# EAGLE design LB_BIT_w16-NAND-v03(1_2) (EAGLE 6.6.0)
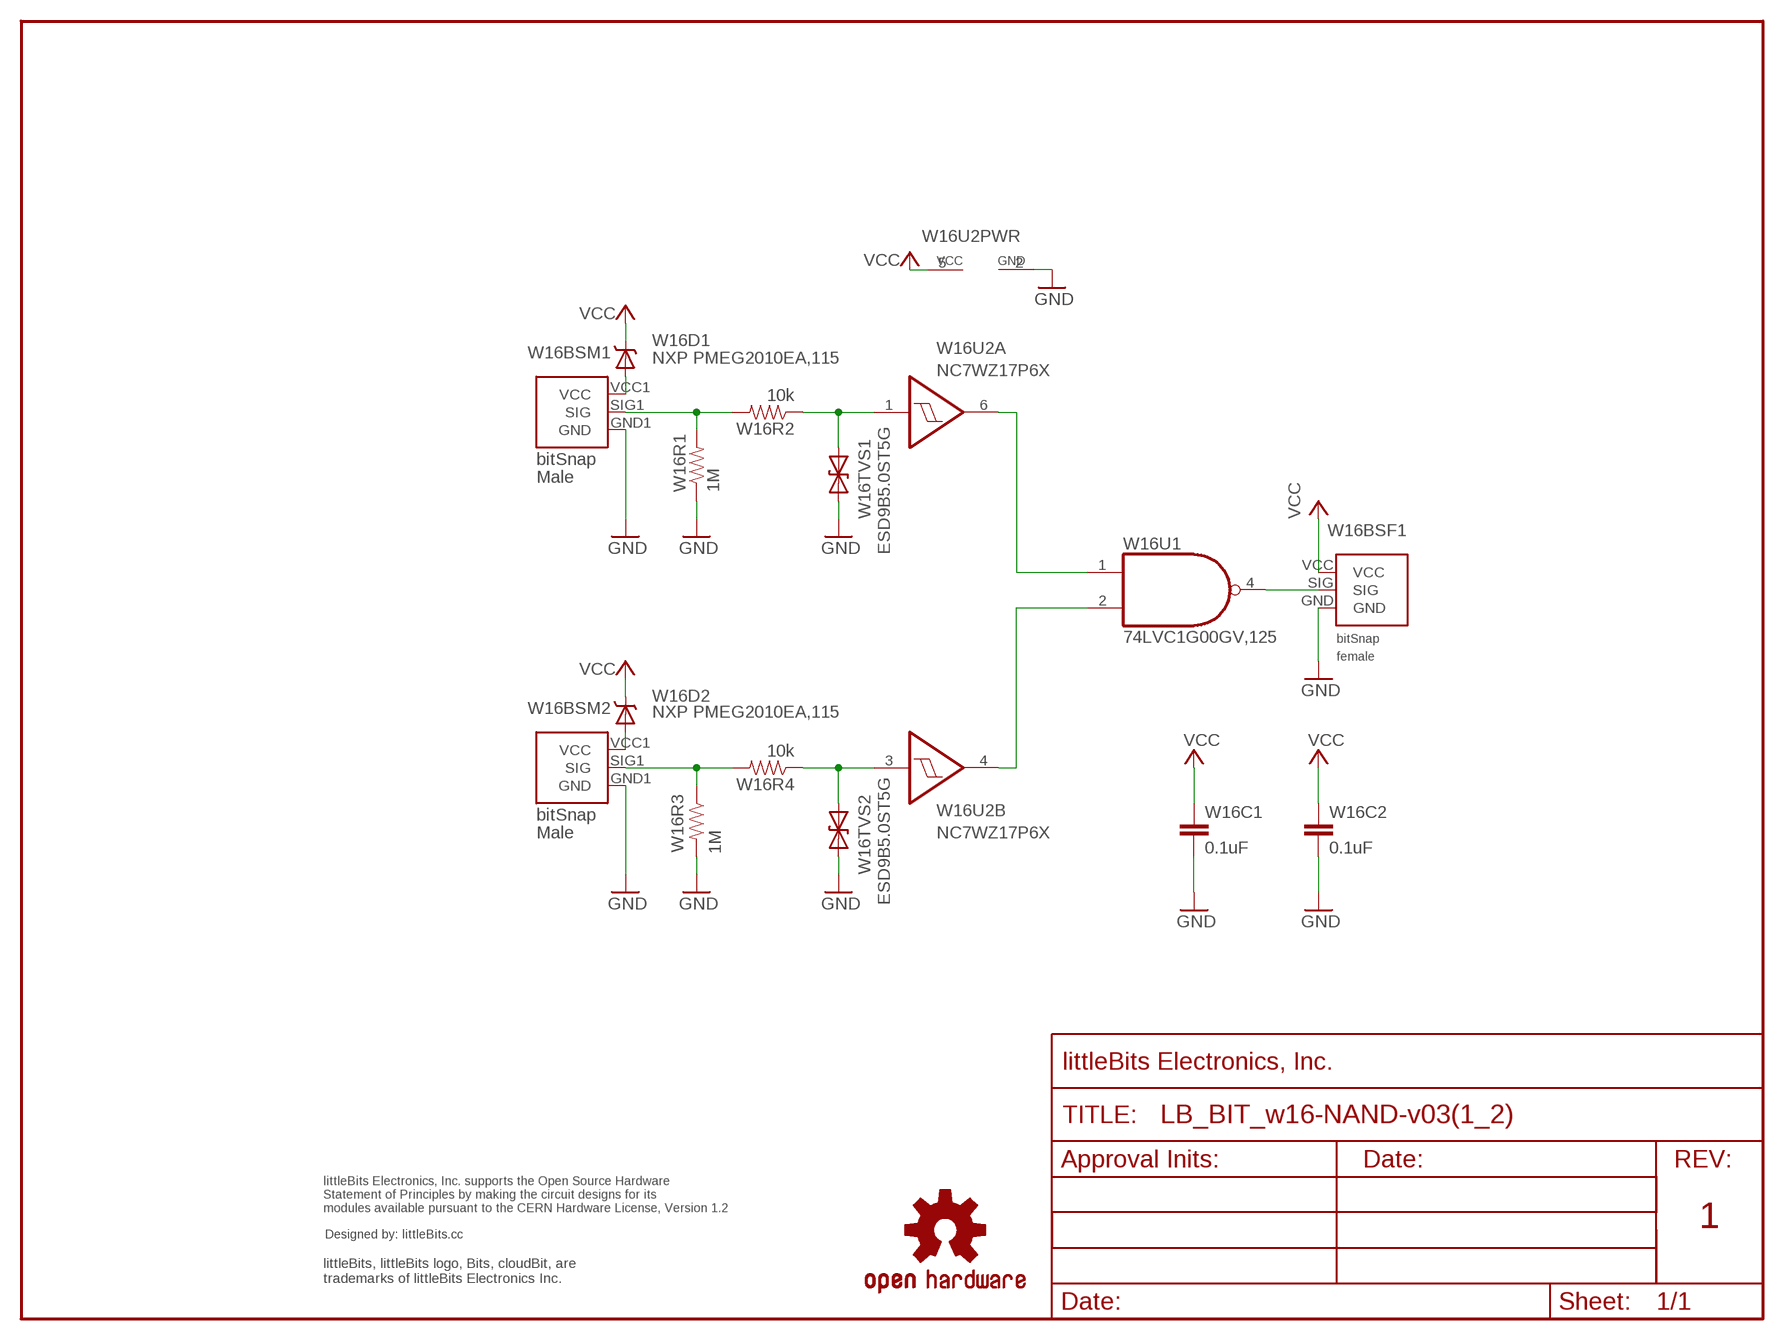
[diagram p0: schematic, sheet 1]

## Parts
U$1  OSHWCREDIT  [OSHWCREDIT]
U$2  OSHW-LOGOL  [OSHW-LOGO-L]
U$7  FRAME-LETTER-OHWOHW  [FABDWG01-OHW]
W16BSF1  BITSNAP_V03_FEMALE  [BITSNAP_V03_FEMALE]
W16BSM1  BITSNAP_V03_MALE  [BITSNAP_V03_MALE]
W16BSM2  BITSNAP_V03_MALE  [BITSNAP_V03_MALE]
W16C1  0.1uF  CAPCAP-0603  [CAP-0603]
W16C2  0.1uF  CAPCAP-0603  [CAP-0603]
W16D1  NXP PMEG2010EA,115  DIODE-SCHOTTKY  [SOD-323]
W16D2  NXP PMEG2010EA,115  DIODE-SCHOTTKY  [SOD-323]
W16R1  1M  RESISTOR0603-RES  [0603-RES]
W16R2  10k  RESISTOR0603-RES  [0603-RES]
W16R3  1M  RESISTOR0603-RES  [0603-RES]
W16R4  10k  RESISTOR0603-RES  [0603-RES]
W16TVS1  ESD9B5.0ST5G  DIODE-TVSSOD-923  [SOD-923]
W16TVS2  ESD9B5.0ST5G  DIODE-TVSSOD-923  [SOD-923]
W16U1  74LVC1G00GV,125  74LVC1G00DBV  [SOT23-5]
W16U2  NC7WZ17P6X  SCHMITT_TRIGGER_NON_INVERTINGNC7WZ17  [SC70-6]

## Nets
GND: W16BSF1.GND W16BSM1.GND1(GND) W16BSM2.GND1(GND) W16C1.2 W16C2.2 W16R1.1 W16R3.2 W16TVS1.1(A) W16TVS2.1(A) W16U2.2(PWR:GND)
N$1: W16BSM2.SIG1(SIG) W16R3.1 W16R4.2
N$2: W16U1.1(I0) W16U2.6(A:O)
N$3: W16BSM1.VCC1(VCC) W16D1.2(A)
N$4: W16U1.2(I1) W16U2.4(B:O)
N$5: W16BSM2.VCC1(VCC) W16D2.2(A)
N$6: W16BSM1.SIG1(SIG) W16R1.2 W16R2.2
N$7: W16R2.1 W16TVS1.2(C) W16U2.1(A:I)
N$8: W16R4.1 W16TVS2.2(C) W16U2.3(B:I)
N$9: W16BSF1.SIG W16U1.4(O)
VCC: W16BSF1.VCC W16C1.1 W16C2.1 W16D1.1(C) W16D2.1(C) W16U2.5(PWR:VCC)

## Notes on the sheet
- 1

## Power pins joined to a net without a drawn wire
GND: W16U1.3(GND)
VCC: W16U1.5(VCC)

## Library data of the parts
U$1 = LITTLEBITS:OSHWCREDIT
U$2 = SparkFun_NEW:OSHW-LOGO: Open Source Hardware Logo This logo indicates the piece of hardware it is found on incorporates a OSHW license and/or adheres to the definition of open source hardware found here: http://freedomdefined.org/OSHW
U$7 = LITTLEBITS:FRAME-LETTER-OHW
W16BSF1 = bitSnap:BITSNAP_V03_FEMALE
W16BSM1 W16BSM2 = bitSnap:BITSNAP_V03_MALE
W16C1 W16C2 = LITTLEBITS:CAP
W16D1 W16D2 = LITTLEBITS:DIODE-SCHOTTKY
W16R1-W16R4 = SparkFun:RESISTOR: Resistor Basic schematic elements and footprints for 0603, 1206, and PTH 1/10th watt (small) resistors.
W16TVS1 W16TVS2 = LITTLEBITS:DIODE-TVS: Bidirectional Transient Voltage Suppression Diode: Device conducts in avalanche mode after reaching a part dependent voltage threshold. Used for limiting voltage spikes on ESD sensitive inputs and outputs.; IEC_ESD_PROT0: +/-18kV; LB_PN: ?; MPN: ESD9B5.0ST5G; V_CLAMP: ?; V_OPERATION: 5V
W16U1 = 74xx-little-us:74*1G00: 2-input NAND gate
W16U2 = LITTLEBITS:SCHMITT_TRIGGER_NON_INVERTING

## Board
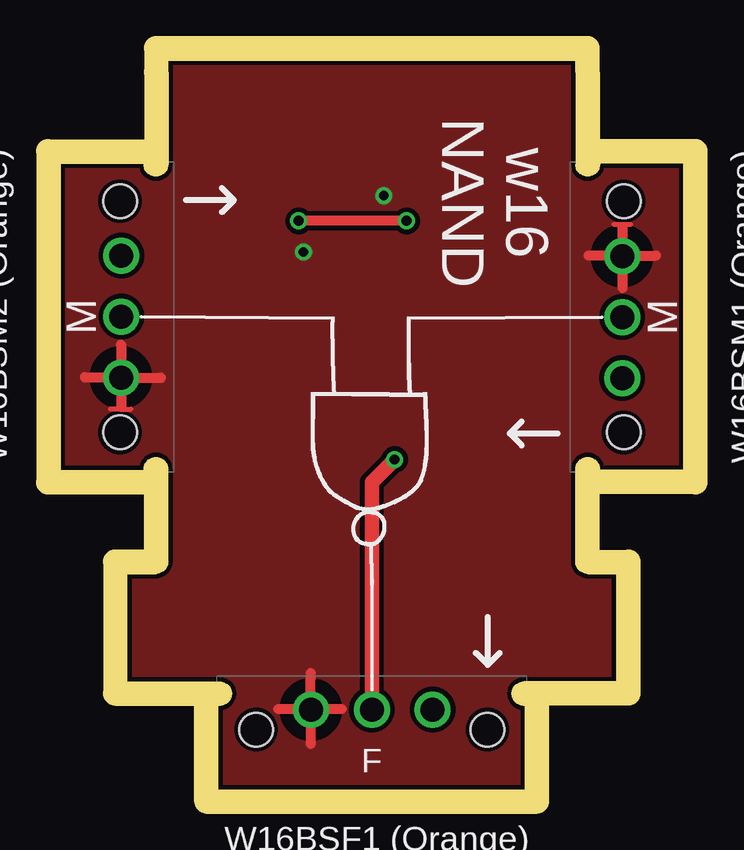
[diagram p1: board, top side]
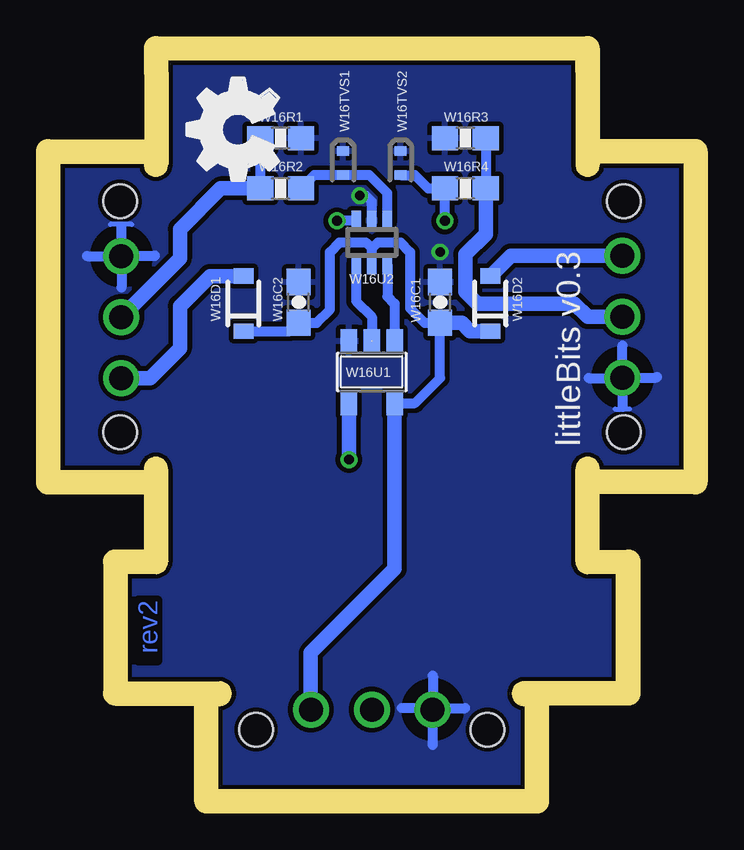
[diagram p2: board, bottom side, seen from below]

Size 26 x 30.4 mm. Coordinates in mm from the lower left corner, seen from the top.
Outline: 2.8,4.5 2.8,9 4,9 arc90 4.5,9.5 4.5,9.51
Outline: 23.2,4.5 23.2,9 22,9 arc-90 21.5,9.5 21.5,9.51
Outline: 4.5,29.9 4.5,30.4 21.5,30.4 21.5,29.9
Copper layers (1*16): Top 0.035mm / dielectric 1.5mm / Bottom 0.035mm
Design rules "littleBitsDRC": minimum track width 0.2mm, minimum drill 0.4mm, track to track 0.2mm, track to pad 0.2mm, pad to pad 0.2mm, via to via 0.2mm, smd to smd 0mil, copper to edge 0.2mm, drill to drill 0.2mm, minimum pad ring 0.2mm, minimum via ring 0.15mm, stop-mask expansion 0.1mm, vias tented up to drill 0mil, thermal gap 0.2mm
tRestrict: area 9.4,2.2 to 11.6,4.4; area 1.4,16.1 to 3.6,18.3; area 22.3,21.1 to 24.5,23.3
bRestrict: area 22.3,21.1 to 24.5,23.3; area 9.4,2.2 to 11.6,4.4; area 1.4,16.1 to 3.6,18.3
Milling: 9 lines

### Footprints (pad centres in the part's own frame; a part is rotated, then mirrored left to right if it is on the bottom)
BITSNAP_V03_FEMALE = drill 1: GND 3.91,3.33; SIG 6.45,3.33; VCC 8.99,3.33 | hole 1.4: 1.63,2.5; 11.27,2.5
BITSNAP_V03_MALE = drill 1: GND1 8.98,2.56; SIG1 6.44,2.56; VCC1 3.9,2.56 | hole 1.4: 11.27,2.5; 1.63,2.5
CAP-0603 = smd 1.1 x 1: 1 -0.85,0; 2 0.85,0
SOD-323 = smd 0.63 x 0.83: 1 -1.15,0; 2 1.15,0
0603-RES = smd 1.1 x 1: 1 -0.85,0; 2 0.85,0
SOD-923 = smd 0.4 x 0.5: 1 -0.5,0; 2 0.5,0
SOT23-5 = smd 0.69 x 0.99: 1 -0.95,-1.29; 2 0,-1.29; 3 0.95,-1.29; 4 0.95,1.3; 5 -0.95,1.3
SC70-6 = smd 0.4 x 0.85: 1 -0.65,-0.9; 2 0,-0.9; 3 0.65,-0.9; 4 0.65,0.9; 5 0,0.9; 6 -0.65,0.9

### Placement (x,y rotation side)
U$1  -94,-60.75 0 top  (outside the outline)
U$2  -32.32,-66.26 0 top  (outside the outline)
U$4  [NAND_IMAGE]  10.45,19.7 270 top
U$6  [OSHW_FILLX150_NOTEXT]  16.9,24.55 0 top
U$7  -2.2,0 0 top
W16BSF1  6.55,0 0 top
W16BSM1  26,13.25 90 top
W16BSM2  0,26.15 270 top
W16C1  10.15,20.3 90 bottom
W16C2  16.05,20.3 90 bottom
W16D1  18.35,20.25 90 bottom
W16D2  8.05,20.25 90 bottom
W16R1  16.8,27.15 180 bottom
W16R2  16.8,25.05 180 bottom
W16R3  9.1,27.15 180 bottom
W16R4  9.1,25.05 0 bottom
W16TVS1  14.2,26.1 270 bottom
W16TVS2  11.8,26.1 270 bottom
W16U1  13,17.4 180 bottom
W16U2  13,22.8 180 bottom

### Tracks (layer width: path | path; a pad name or v marks a point on that pad's centre or on a via)
GND  (via drill 0.41)
  Top 0.203: 2.55,15.95 2.55,15.85 | 2.55,15.85 2.1,15.85 | 2.55,15.85 2.95,15.85 | 23.1,23.55 23.8,23.55
  Top 0.406: W16BSM2.GND1 | W16BSM2.GND1 1.05,17.17 1.05,17.2 | W16BSM2.GND1 4.2,17.17 4.2,17.15 | 2.55,18.55 2.55,16.65 | 2.55,16.65 2.55,15.95 | W16BSM2.GND1 2.56,16.66 2.55,16.65 | 10.46,4.85 10.45,4.85 | W16BSF1.GND | W16BSF1.GND 10.45,1.9 | W16BSF1.GND 10.45,3.35 | 10.45,3.35 9.1,3.35 | 11.75,3.35 10.45,3.35 | W16BSM1.GND1 23.46,22.25 | 23.46,22.25 24.85,22.25 | 23.46,22.25 23.45,22.25 | 23.45,22.25 23.45,20.9 | 23.45,23.4 23.45,22.25 | 23.45,22.25 22.05,22.25 | 10.45,3.35 10.45,4.65
  Bottom 0.203: 2.25,15.85 2.7,15.85 | 23,23.55 23.9,23.55 | 2.85,15.85 2.7,15.85 | 2.7,15.85 arc-90 2.55,15.95
  Bottom 0.406: W16U2.2 13,24.5 13.25,24.75 v13.5,24.75 | 1.13,17.17 1.1,17.2 | 10.45,4.75 10.45,3.4 | 10.45,1.85 10.45,3.4 | 10.45,3.4 9.1,3.4 | 10.45,3.4 11.75,3.4 | 22.05,22.25 22.05,22.23 W16BSM1.GND1 | 24.87,22.23 W16BSM1.GND1 | W16BSM1.GND1 23.43,20.93 | W16BSM1.GND1 23.43,23.43 | 1.2,17.15 2.55,17.15 | 3.95,17.15 2.55,17.15 | 2.55,17.15 2.55,18.5 | 2.55,17.15 2.55,15.95
  other vias: 10.15,22.4
  pour Top: 0.22,30.2 25.8,30.2 25.7,0.22 0.27,0.27
  pour Bottom: 0.22,30.2 25.8,30.2 25.7,0.22 0.27,0.27
N$1
  Bottom 0.406: W16R3.1 W16R4.2
  Bottom 0.61: W16R4.2 8.25,23.15 9.1,22.3 9.1,20.75 8.6,20.25 4.55,20.25 4,19.7 W16BSM2.SIG1
N$2
  Bottom 0.406: W16U2.6 12.35,20.55 12.05,20.25 W16U1.1
N$3
  Bottom 0.61: W16D1.2 19.75,21.4 21,20.15 21,18.4 22.25,17.15 W16BSM1.VCC1
N$4
  Bottom 0.406: W16U2.4 13.65,20.35 13,19.7 W16U1.2
N$5
  Bottom 0.61: W16BSM2.VCC1 7.2,22.25 W16D2.2
N$6
  Bottom 0.406: W16R1.2 W16R2.2
  Bottom 0.61: W16R2.2 19.3,25.05 21,23.35 21,22.13 W16BSM1.SIG1
N$7
  Bottom 0.406: W16U2.1 12.35,24.85 13.1,25.6 W16TVS1.2 15.4,25.6 W16R2.1
N$8  (via drill 0.41)
  Top 0.406: v14.45,23.7 v9.95,23.7
  Bottom 0.406: W16TVS2.2 11.2,25.6 10.65,25.05 W16R4.1 v9.95,23.7 | W16U2.3 v14.45,23.7
N$9  (via drill 0.41)
  Top 0.61: W16BSF1.SIG 13,12.8 v13.95,13.75
  Bottom 0.61: v13.95,13.75 W16U1.4
VCC
  Bottom 0.406: W16U2.5 13,22.55 | 13,22.55 12.75,22.8 11.8,22.8 11.4,22.4 11.4,20.05 10.8,19.45 W16C1.1 10.15,17.15 11.2,16.1 W16U1.5 | 13,22.55 13.25,22.8 14.35,22.8 14.75,22.4 14.75,20 15.3,19.45 W16C2.1 16.4,19.1 W16D1.1
  Bottom 0.61: W16C1.1 9.25,19.45 8.9,19.1 W16D2.1 | W16U1.5 12.05,9.2 15.55,5.7 W16BSF1.VCC
  Bottom 0.813: W16BSF1.VCC

### Text on the board
Bottom: rev2
tPlace: w16 / NAND
bPlace: littleBits v0.3
tNames: W16BSM2 (Orange) | W16BSM1 (Orange) | W16BSF1 (Orange)
Milling: 1mm DIA. ROUTER PATH
Reference: LARGE
dxf: 2 | NOT AND Bit